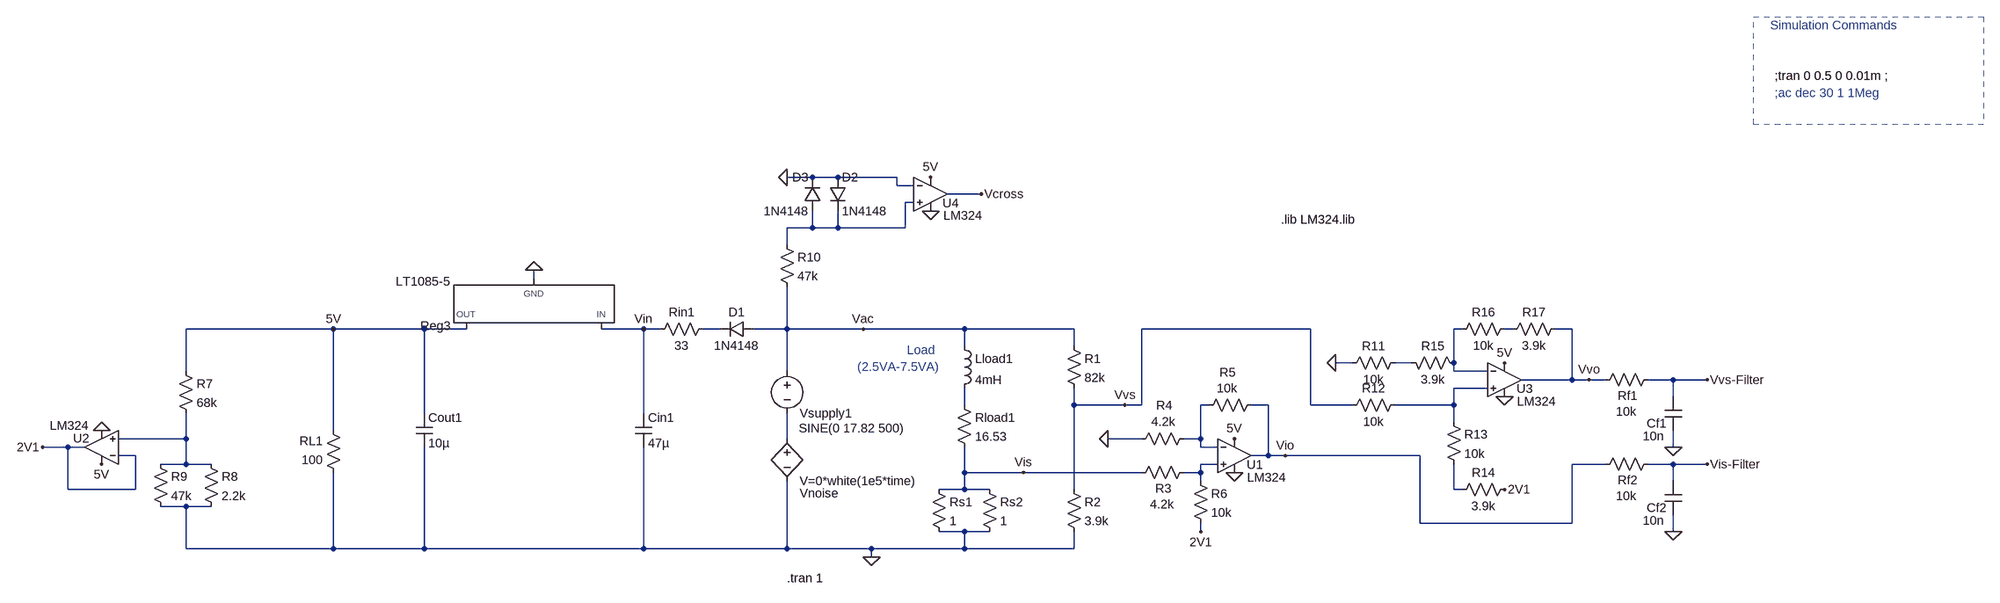
[diagram p0: schematic Sam Finished.asc]
Sam Finished.asc, the LTspice schematic file:
Version 4
SHEET 1 3108 680
WIRE 128 -608 80 -608
WIRE 176 -608 128 -608
WIRE 288 -608 176 -608
WIRE 288 -592 288 -608
WIRE 320 -592 288 -592
WIRE 448 -576 384 -576
WIRE 320 -560 304 -560
WIRE 128 -512 128 -544
WIRE 128 -512 80 -512
WIRE 176 -512 176 -544
WIRE 176 -512 128 -512
WIRE 304 -512 304 -560
WIRE 304 -512 176 -512
WIRE 80 -480 80 -512
WIRE -400 -416 -400 -432
WIRE -880 -320 -1168 -320
WIRE -608 -320 -880 -320
WIRE -528 -320 -608 -320
WIRE -192 -320 -272 -320
WIRE -160 -320 -192 -320
WIRE -48 -320 -80 -320
WIRE 80 -320 80 -400
WIRE 80 -320 16 -320
WIRE 224 -320 80 -320
WIRE 416 -320 224 -320
WIRE 624 -320 416 -320
WIRE 1072 -320 752 -320
WIRE 1360 -320 1344 -320
WIRE 1456 -320 1440 -320
WIRE 1568 -320 1536 -320
WIRE 416 -288 416 -320
WIRE 624 -288 624 -320
WIRE 1152 -256 1120 -256
WIRE 1264 -256 1232 -256
WIRE 1344 -256 1344 -320
WIRE -1168 -240 -1168 -320
WIRE 80 -240 80 -320
WIRE 1344 -240 1344 -256
WIRE 1408 -240 1344 -240
WIRE 1568 -224 1568 -320
WIRE 1568 -224 1472 -224
WIRE 1600 -224 1568 -224
WIRE 1632 -224 1600 -224
WIRE 1760 -224 1712 -224
WIRE 1824 -224 1760 -224
WIRE 1408 -208 1344 -208
WIRE 1760 -192 1760 -224
WIRE 416 -176 416 -208
WIRE 624 -176 624 -208
WIRE 720 -176 624 -176
WIRE 752 -176 752 -320
WIRE 752 -176 720 -176
WIRE 880 -176 864 -176
WIRE 992 -176 960 -176
WIRE 1072 -176 1072 -320
WIRE 1152 -176 1072 -176
WIRE 1344 -176 1344 -208
WIRE 1344 -176 1232 -176
WIRE -608 -160 -608 -320
WIRE -192 -160 -192 -320
WIRE 1344 -144 1344 -176
WIRE -880 -128 -880 -320
WIRE -1168 -112 -1168 -160
WIRE -1168 -112 -1296 -112
WIRE 80 -112 80 -160
WIRE 752 -112 688 -112
WIRE 864 -112 864 -176
WIRE 864 -112 832 -112
WIRE -1392 -96 -1440 -96
WIRE -1360 -96 -1392 -96
WIRE 864 -96 864 -112
WIRE 896 -96 864 -96
WIRE 1760 -96 1760 -128
WIRE -1264 -80 -1296 -80
WIRE 992 -80 992 -176
WIRE 992 -80 960 -80
WIRE 1024 -80 992 -80
WIRE 1280 -80 1024 -80
WIRE -1168 -64 -1168 -112
WIRE -1168 -64 -1216 -64
WIRE -1120 -64 -1168 -64
WIRE 896 -64 864 -64
WIRE 1632 -64 1568 -64
WIRE 1760 -64 1712 -64
WIRE 1824 -64 1760 -64
WIRE 416 -48 416 -96
WIRE 528 -48 416 -48
WIRE 752 -48 528 -48
WIRE 864 -48 864 -64
WIRE 864 -48 832 -48
WIRE 864 -32 864 -48
WIRE 1760 -32 1760 -64
WIRE -1392 -16 -1392 -96
WIRE -1264 -16 -1264 -80
WIRE -1264 -16 -1392 -16
WIRE 416 -16 416 -48
WIRE 416 -16 368 -16
WIRE 464 -16 416 -16
WIRE 624 -16 624 -176
WIRE 1344 -16 1344 -64
WIRE 1360 -16 1344 -16
WIRE -1168 16 -1216 16
WIRE -1120 16 -1168 16
WIRE 1280 48 1280 -80
WIRE 1568 48 1568 -64
WIRE 1568 48 1280 48
WIRE 416 64 368 64
WIRE 464 64 416 64
WIRE 864 64 864 48
WIRE 1760 64 1760 32
WIRE -1168 96 -1168 16
WIRE -880 96 -880 -48
WIRE -880 96 -1168 96
WIRE -608 96 -608 -96
WIRE -608 96 -880 96
WIRE -192 96 -192 -96
WIRE -192 96 -608 96
WIRE 80 96 80 -32
WIRE 80 96 -192 96
WIRE 240 96 80 96
WIRE 416 96 416 64
WIRE 416 96 240 96
WIRE 624 96 624 64
WIRE 624 96 416 96
WIRE 240 112 240 96
FLAG 224 -320 Vac
FLAG 528 -48 Vis
FLAG 240 112 0
FLAG 928 -48 0
FLAG 928 -112 5V
FLAG 1024 -80 Vio
FLAG 864 64 2V1
FLAG 688 -112 0
FLAG 720 -176 Vvs
FLAG 1120 -256 0
FLAG 1440 -256 5V
FLAG 1440 -192 0
FLAG 1440 -16 2V1
FLAG 1600 -224 Vvo
FLAG 1760 -96 0
FLAG 1824 -224 Vvs-Filter
FLAG 1760 64 0
FLAG 1824 -64 Vis-Filter
FLAG -192 -320 Vin
FLAG -880 -320 5V
FLAG -400 -432 0
FLAG -1328 -128 0
FLAG -1328 -64 5V
FLAG -1440 -96 2V1
FLAG 352 -544 0
FLAG 352 -608 5V
FLAG 80 -608 0
FLAG 448 -576 Vcross
SYMBOL voltage 80 -256 R0
WINDOW 0 24 96 Left 2
WINDOW 3 22 124 Left 2
WINDOW 123 0 0 Left 0
WINDOW 39 0 0 Left 0
SYMATTR InstName Vsupply1
SYMATTR Value SINE(0 17.82 500)
SYMBOL res 400 -192 R0
SYMATTR InstName Rload1
SYMATTR Value 16.53
SYMBOL ind 400 -304 R0
SYMATTR InstName Lload1
SYMATTR Value 4mH
SYMBOL res 352 -32 R0
SYMATTR InstName Rs1
SYMATTR Value 1
SYMBOL res 448 -32 R0
SYMATTR InstName Rs2
SYMATTR Value 1
SYMBOL res 608 -304 R0
SYMATTR InstName R1
SYMATTR Value 82k
SYMBOL res 608 -32 R0
SYMATTR InstName R2
SYMATTR Value 3.9k
SYMBOL Opamps/opamp2 928 -144 R0
WINDOW 0 23 81 Left 2
WINDOW 3 24 105 Left 2
SYMATTR InstName U1
SYMATTR Value LM324
SYMBOL res 848 -64 R90
WINDOW 0 62 55 VBottom 2
WINDOW 3 61 57 VTop 2
SYMATTR InstName R3
SYMATTR Value 4.2k
SYMBOL res 848 -128 R90
WINDOW 0 -32 53 VBottom 2
WINDOW 3 -32 55 VTop 2
SYMATTR InstName R4
SYMATTR Value 4.2k
SYMBOL res 976 -192 R90
WINDOW 0 -30 61 VBottom 2
WINDOW 3 -31 62 VTop 2
SYMATTR InstName R5
SYMATTR Value 10k
SYMBOL res 848 -48 R0
SYMATTR InstName R6
SYMATTR Value 10k
SYMBOL res 1248 -272 R90
WINDOW 0 0 56 VBottom 2
WINDOW 3 32 56 VTop 2
SYMATTR InstName R11
SYMATTR Value 10k
SYMBOL res 1248 -192 R90
WINDOW 0 0 56 VBottom 2
WINDOW 3 32 56 VTop 2
SYMATTR InstName R12
SYMATTR Value 10k
SYMBOL res 1328 -160 R0
SYMATTR InstName R13
SYMATTR Value 10k
SYMBOL res 1456 -32 R90
WINDOW 0 0 56 VBottom 2
WINDOW 3 32 56 VTop 2
SYMATTR InstName R14
SYMATTR Value 3.9k
SYMBOL res 1248 -272 M90
WINDOW 0 0 56 VBottom 2
WINDOW 3 32 56 VTop 2
SYMATTR InstName R15
SYMATTR Value 3.9k
SYMBOL res 1456 -336 R90
WINDOW 0 0 56 VBottom 2
WINDOW 3 32 56 VTop 2
SYMATTR InstName R16
SYMATTR Value 10k
SYMBOL res 1552 -336 R90
WINDOW 0 0 56 VBottom 2
WINDOW 3 32 56 VTop 2
SYMATTR InstName R17
SYMATTR Value 3.9k
SYMBOL Opamps/opamp2 1440 -288 R0
WINDOW 0 23 81 Left 2
WINDOW 3 24 105 Left 2
SYMATTR InstName U3
SYMATTR Value LM324
SYMBOL res 1728 -240 R90
WINDOW 0 62 55 VBottom 2
WINDOW 3 61 57 VTop 2
SYMATTR InstName Rf1
SYMATTR Value 10k
SYMBOL cap 1776 -128 R180
WINDOW 0 29 13 Left 2
WINDOW 3 33 -11 Left 2
SYMATTR InstName Cf1
SYMATTR Value 10n
SYMBOL res 1728 -80 R90
WINDOW 0 62 55 VBottom 2
WINDOW 3 61 57 VTop 2
SYMATTR InstName Rf2
SYMATTR Value 10k
SYMBOL cap 1776 32 R180
WINDOW 0 29 13 Left 2
WINDOW 3 33 -11 Left 2
SYMATTR InstName Cf2
SYMATTR Value 10n
SYMBOL bv 80 -128 R0
WINDOW 0 24 119 Left 2
SYMATTR InstName Vnoise
SYMATTR Value V=0*white(1e5*time)
SYMBOL res -176 -304 R270
WINDOW 0 32 56 VTop 2
WINDOW 3 0 56 VBottom 2
SYMATTR InstName Rin1
SYMATTR Value 33
SYMBOL diode 16 -336 R90
WINDOW 0 0 32 VBottom 2
WINDOW 3 32 32 VTop 2
SYMATTR InstName D1
SYMATTR Value 1N4148
SYMBOL cap -208 -160 R0
SYMATTR InstName Cin1
SYMATTR Value 47µ
SYMATTR SpiceLine Rser=0.001
SYMBOL cap -624 -160 R0
SYMATTR InstName Cout1
SYMATTR Value 10µ
SYMATTR SpiceLine Rser=0.001
SYMBOL res -864 -32 R180
WINDOW 0 36 76 Left 2
WINDOW 3 36 40 Left 2
SYMATTR InstName RL1
SYMATTR Value 100
SYMBOL PowerProducts/LT1085-5 -400 -320 R180
SYMATTR InstName Reg3
SYMBOL res -1184 -256 R0
SYMATTR InstName R7
SYMATTR Value 68k
SYMBOL Opamps/opamp2 -1328 -32 R180
WINDOW 0 23 81 Left 2
WINDOW 3 24 105 Left 2
SYMATTR InstName U2
SYMATTR Value LM324
SYMBOL res -1232 -80 R0
SYMATTR InstName R9
SYMATTR Value 47k
SYMBOL res -1136 -80 R0
SYMATTR InstName R8
SYMATTR Value 2.2k
SYMBOL Opamps/opamp2 352 -640 R0
WINDOW 0 23 81 Left 2
WINDOW 3 24 105 Left 2
SYMATTR InstName U4
SYMATTR Value LM324
SYMBOL diode 160 -608 R0
SYMATTR InstName D2
SYMATTR Value 1N4148
SYMBOL res 64 -496 R0
SYMATTR InstName R10
SYMATTR Value 47k
SYMBOL diode 144 -544 R180
WINDOW 0 24 64 Left 2
WINDOW 3 24 0 Left 2
SYMATTR InstName D3
SYMATTR Value 1N4148
TEXT 368 -280 Right 2 ;Load \n(2.5VA-7.5VA)
TEXT 80 152 Left 2 !.tran 1
TEXT 1016 -528 Left 2 !.lib LM324.lib
TEXT 1952 -768 Left 2 ;;ac dec 30 1 1Meg
TEXT 1944 -896 Left 2 ;Simulation Commands
TEXT 1952 -800 Left 2 !;tran 0 0.5 0 0.01m ;
RECTANGLE Normal 1912 -912 2348 -708 2

The netlist it stands for:
* Sam Finished.asc
Vsupply1 Vac N010 SINE(0 17.82 500)
Rload1 N007 Vis 16.53
Lload1 Vac N007 4mH
Rs1 Vis 0 1
Rs2 Vis 0 1
R1 Vac Vvs 82k
R2 Vvs 0 3.9k
XU1 N011 N008 5V 0 Vio LM324  ; pins In+ In- V+ V- OUT
R3 N011 Vis 4.2k
R4 N008 0 4.2k
R5 Vio N008 10k
R6 N011 2V1 10k
R11 N005 0 10k
R12 N006 Vvs 10k
R13 N006 N012 10k
R14 2V1 N012 3.9k
R15 N005 N003 3.9k
R16 N004 N003 10k
R17 Vvo N004 3.9k
XU3 N006 N003 5V 0 Vvo LM324  ; pins In+ In- V+ V- OUT
Rf1 Vvs-Filter Vvo 10k
Cf1 0 Vvs-Filter 10n
Rf2 Vis-Filter Vio 10k
Cf2 0 Vis-Filter 10n
B§Vnoise N010 0 V=0*white(1e5*time)
Rin1 Vin N002 33
D1 Vac N002 1N4148
Cin1 Vin 0 47µ Rser=0.001
Cout1 5V 0 10µ Rser=0.001
RL1 0 5V 100
XReg3 0 5V Vin LT1085-5  ; pins GND OUT IN
R7 5V N009 68k
XU2 N009 2V1 5V 0 2V1 LM324  ; pins In+ In- V+ V- OUT
R9 N009 0 47k
R8 N009 0 2.2k
XU4 N001 0 5V 0 Vcross LM324  ; pins In+ In- V+ V- OUT
D2 0 N001 1N4148
R10 N001 Vac 47k
D3 N001 0 1N4148
.model D D
.lib standard.dio
* Load
* (2.5VA-7.5VA)
.tran 1
.lib LM324.lib
* ;ac dec 30 1 1Meg
* Simulation Commands
;tran 0 0.5 0 0.01m ;
.backanno
.end